# Altium schematic sheet Power Input_V2.SchDoc
size A3; SheetNumber: 2; SheetTotal: 6
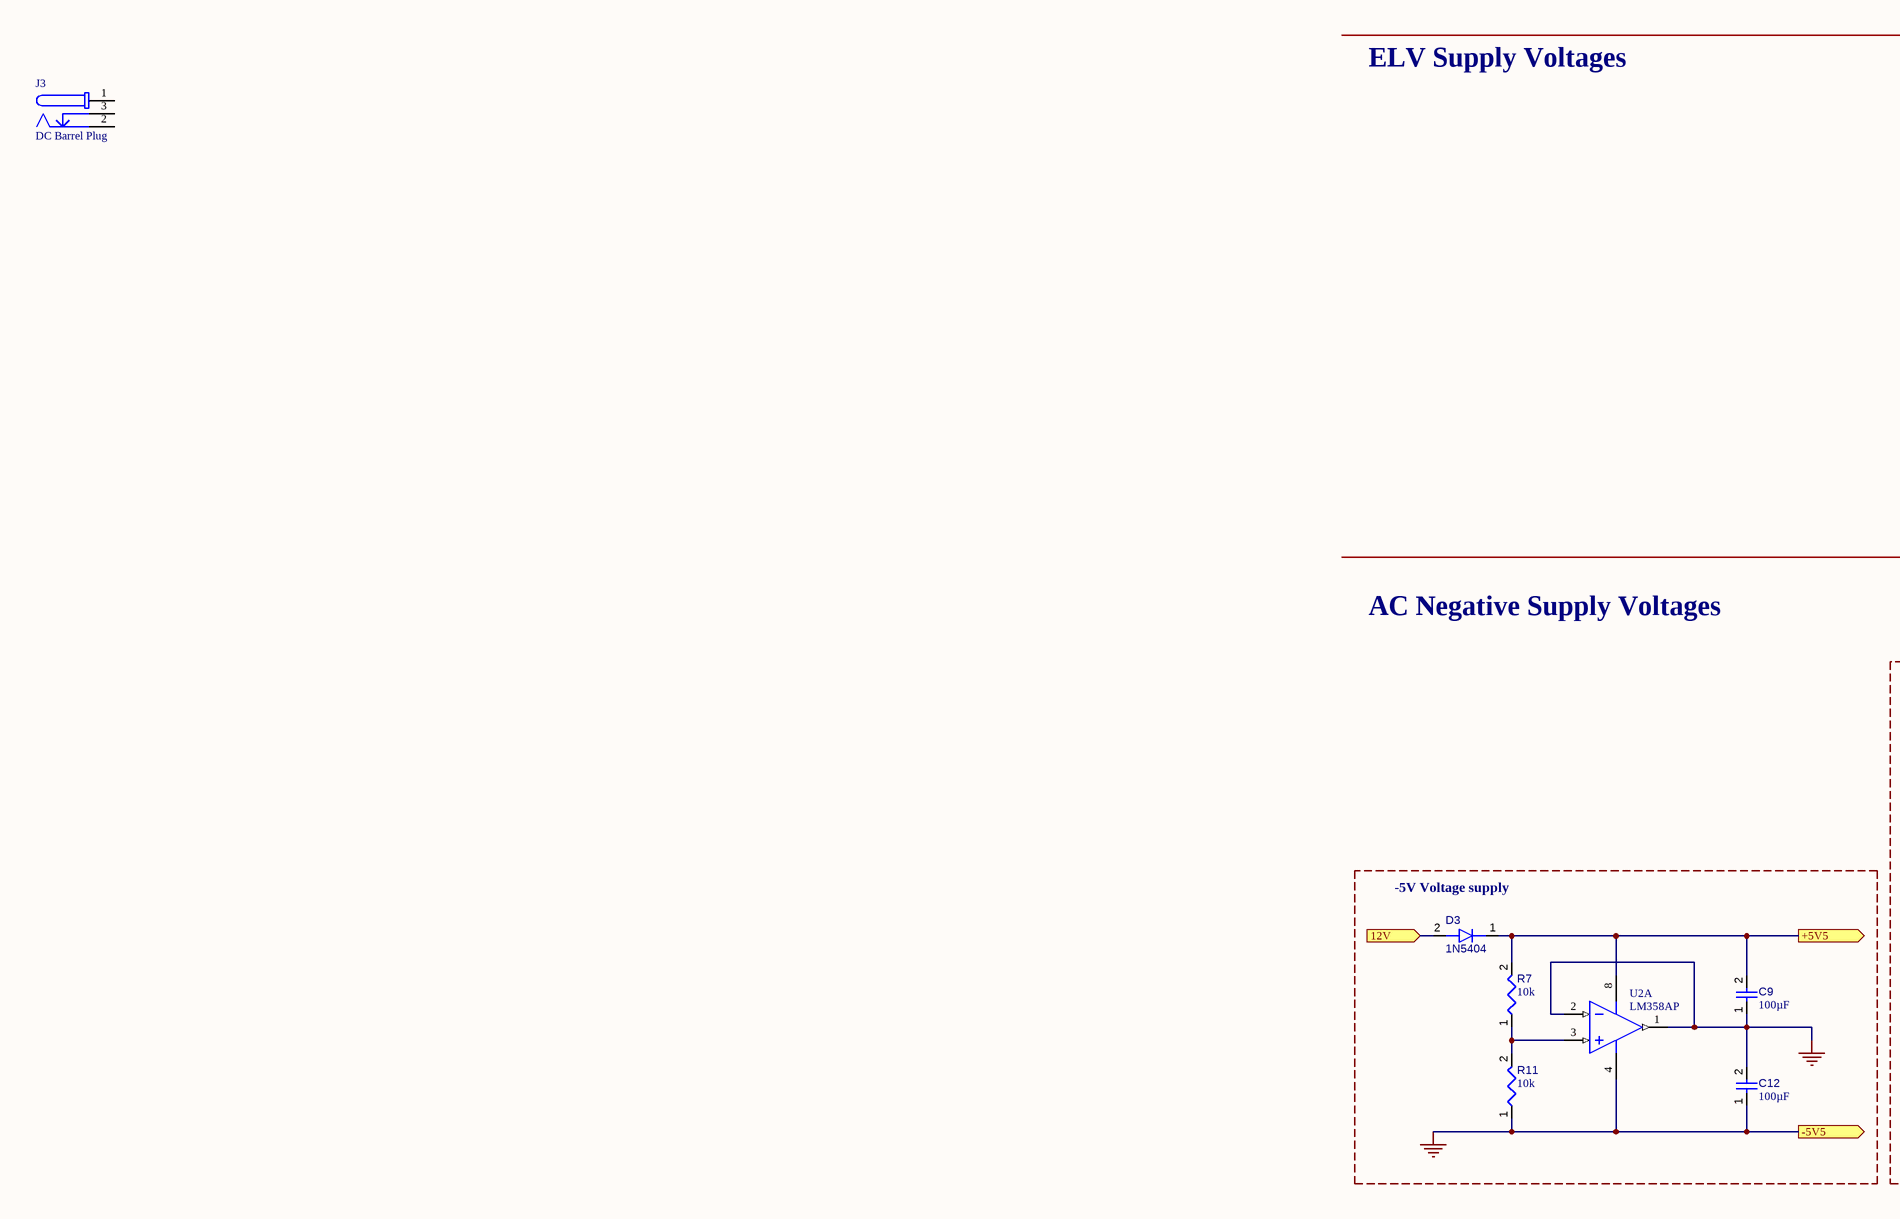
[diagram p0: Power Input_V2.SchDoc, left]
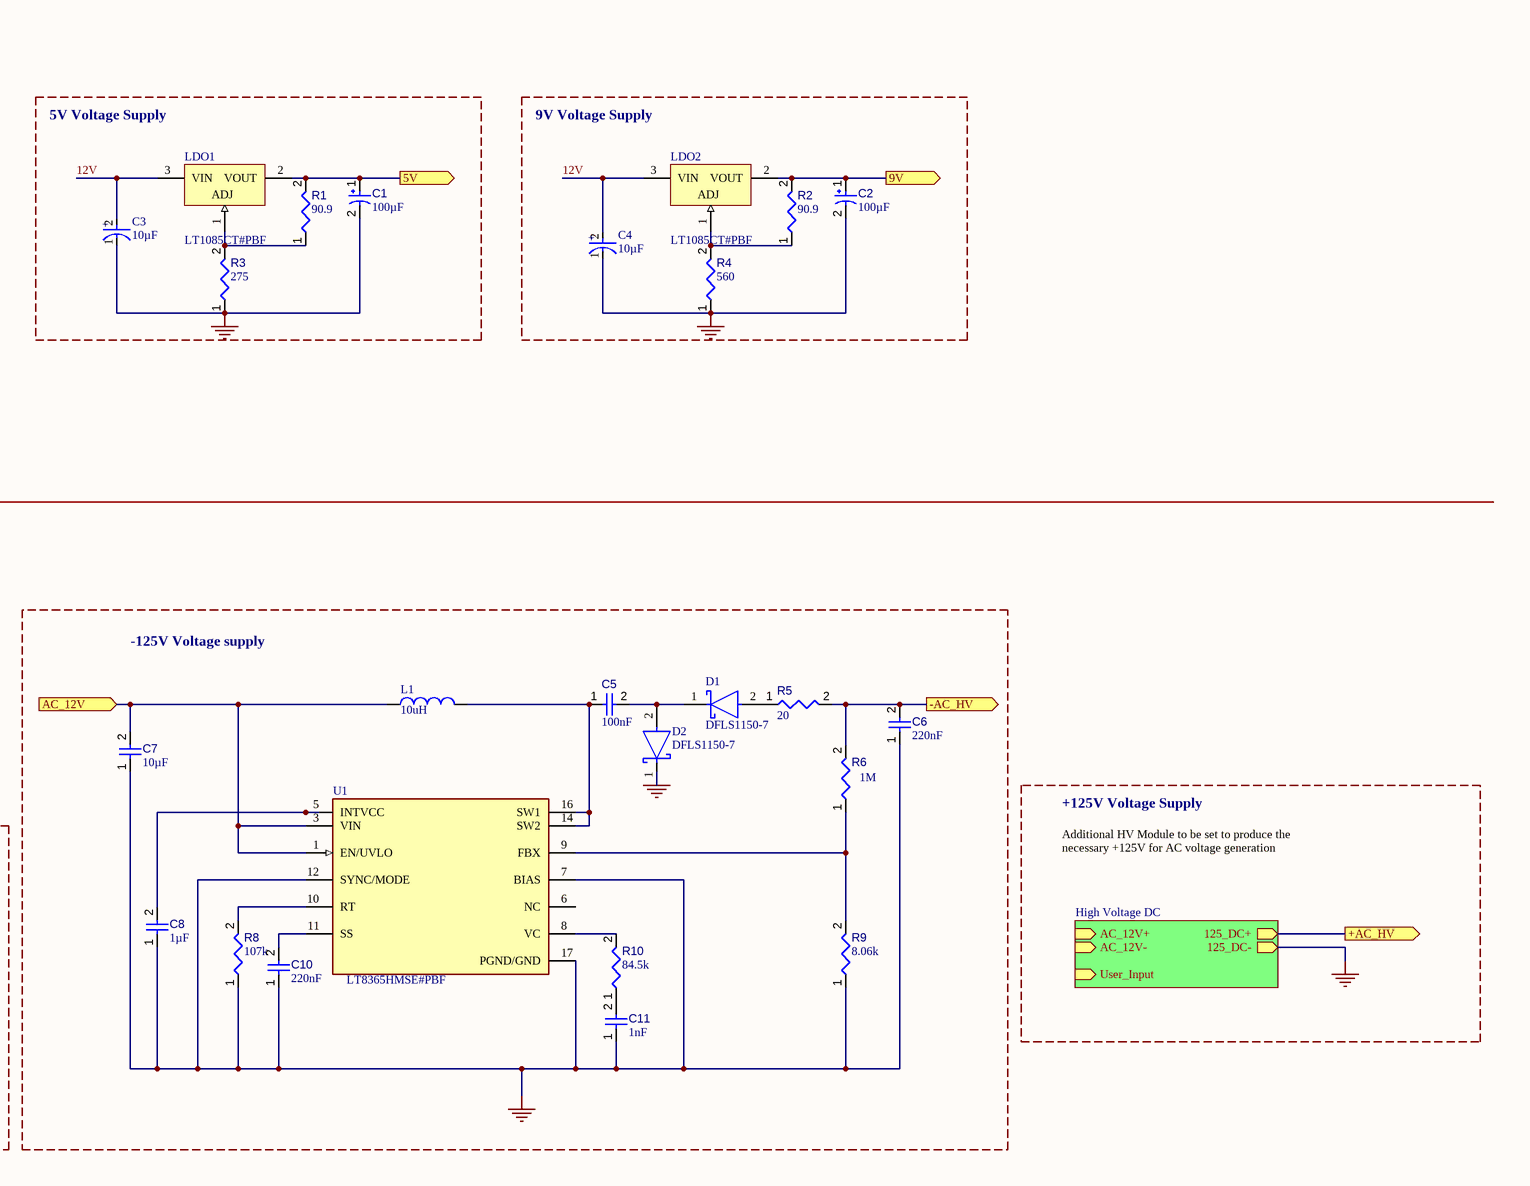
[diagram p1: Power Input_V2.SchDoc, right]

## Parts
C1  value 100µF  [KEMT-T491-D_N]  (hidden comment: T491D107K010AT)
C2  value 100µF  [KEMT-T491-D_N]  (hidden comment: T491D107K010AT)
C3  value 10µF  [FP-T491B106K020AT-MFG]  (hidden comment: T491B106K020AT)
C4  value 10µF  [FP-T491B106K020AT-MFG]  (hidden comment: T491B106K020AT)
C5  value 100nF  [CAPC1210(3225)170_L]  (hidden comment: C1210C104J1RACTU)
C6  value 220nF  [CAPC0402(1005)60_L]  (hidden comment: Capacitor 220nF +/-20% 10V 0402)
C7  value 10µF  [CAPC2013X135X45NL10T25]  (hidden comment: Capacitor 10 uF +/- 10% 16 V 0805)
C8  value 1µF  [CAPC3216X180X20ML20]  (hidden comment: Capacitor 1 uF +/- 10% 25 V 1206)
C9  value 100µF  [RXJ101M1EBK-0811P-Footprint-1]  (hidden comment: RXJ101M1EBK-0811P)
C10  value 220nF  [CAPC0402(1005)60_L]  (hidden comment: Capacitor 220nF +/-20% 10V 0402)
C11  value 1nF  [CAPC0402(1005)33_L]  (hidden comment: Capacitor 1nF +/-20% 50V 0402)
C12  value 100µF  [RXJ101M1EBK-0811P-Footprint-1]  (hidden comment: RXJ101M1EBK-0811P)
D1  DFLS1150-7  [FP-PowerDI123-MFG]
D2  DFLS1150-7  [FP-PowerDI123-MFG]
D3  1N5404  [ONSC-AXIAL_LEAD-2-267-05_V]
J3  DC Barrel Plug  [694108106102]
L1  value 10uH  [WE-LHMI_4020]  (hidden comment: 74437324100)
LDO1  LT1085CT#PBF  [LT-T-3]
LDO2  LT1085CT#PBF  [LT-T-3]
R1  value 90.9  [RESC3216X70X50NL05T20]  (hidden comment: ERJ-8ENF90R9V)
R2  value 90.9  [RESC3216X70X50NL05T20]  (hidden comment: ERJ-8ENF90R9V)
R3  value 275  [1-1879643-4-Footprint-1]  (hidden comment: 1-1879643-4)
R4  value 560  [RESC3216X70X50NL20T25]  (hidden comment: ERA-8AEB561V)
R5  value 20  [RESC3216X70X50NL05T20]  (hidden comment: ERJ-8ENF20R0V)
R6  value 1M  [RESC2550X06N]  (hidden comment: 3430H2F1M0TDF)
R7  value 10k  [FP-MF0207-MFG]  (hidden comment: MF0207FTE52-10K)
R8  value 107k  (hidden comment: MBA02040C1073FC100)
R9  value 8.06k  (hidden comment: MFR-25FTF52-8K06)
R10  value 84.5k  [FP-CR1206-IPC_C]  (hidden comment: CR1206-FX-8452ELF)
R11  value 10k  [FP-MF0207-MFG]  (hidden comment: MF0207FTE52-10K)
U1  LT8365HMSE#PBF  [FP-MSE-16-05-08-1871-MFG]
U2  LM358AP  [P0008A]  (part A of 2)

## Blocks framed on the sheet
5V Voltage Supply: C1 C3 LDO1 R1 R3
9V Voltage Supply: C2 C4 LDO2 R2 R4
-125V Voltage supply: C5-C8 C10 C11 D1 D2 L1 R5 R6 R8-R10 U1
-5V Voltage supply: C9 C12 D3 R7 R11 U2

## Sub-sheets
High Voltage DC = File Name: AC_12V+ (in), AC_12V- (in), User_Input (in), 125_DC+ (out), 125_DC- (out)

## Ports
5V (out), 9V (out), 12V (in), +5V5 (out), +AC_HV (out), -5V5 (out), -AC_HV (out), AC_12V (in)

## Nets
GND: C1.2 C2.2 C3.1(C) C4.1(C) C6.1 C7.1 C8.1 C9.1 C10.1 C11.1 C12.1 C12.2 D2.1(C) R3.1 R4.1 R8.1 R9.1 R11.1 U1.7(BIAS) U1.12(SYNC/MODE) U1.17(PGND/GND) U2.1(1OUT) U2.2(1IN-) U2.4(GND) ; port -5V5, sheet High Voltage DC/125_DC-
5V: C1.1 LDO1.2(VOUT) R1.2 ; port 5V
9V: C2.1 LDO2.2(VOUT) R2.2 ; port 9V
12V: D3.2(A) ; port 12V
12V: C3.2(A) C4.2(A) LDO1.3(VIN) LDO2.3(VIN)  [a separate net that carries the same name]
+5V5: C9.2 D3.1(K) R7.2 U2.8(VCC) ; port +5V5
+AC_HV: port +AC_HV, sheet High Voltage DC/125_DC+
-AC_HV: C6.2 R5.2 R6.2 ; port -AC_HV
AC_12V: C7.2 L1.1 U1.1(EN/UVLO) U1.3(VIN) ; port AC_12V
NetC5_1: C5.1 L1.2 U1.14(SW2) U1.16(SW1)
NetC5_2: C5.2 D1.1(C) D2.2(A)
NetC8_2: C8.2 U1.5(INTVCC)
NetC10_2: C10.2 U1.11(SS)
NetC11_2: C11.2 R10.1
NetD1_2: D1.2(A) R5.1
NetLDO1_1: LDO1.1(ADJ) R1.1 R3.2
NetLDO2_1: LDO2.1(ADJ) R2.1 R4.2
NetR6_1: R6.1 R9.2 U1.9(FBX)
NetR7_1: R7.1 R11.2 U2.3(1IN+)
NetR8_2: R8.2 U1.10(RT)
NetR10_2: R10.2 U1.8(VC)

Not connected (* = marked no-connect by the designer): J3 1 2 3; U1 6(NC)

## Notes on the sheet
- ELV Supply Voltages
- AC Negative Supply Voltages
- +125V Voltage Supply
- Additional HV Module to be set to produce the necessary +125V for AC voltage generation
- (in symbol CMP-001-00088-1) +

## Library data of the parts
C1 C2 = CMP-001-00037-7: Tantalum Surface Mount Capacitor-Standard Tantalum, 100 uF, +/- 10%, 10 V, -55 to 125 degC, 2917 (7343 Metric), RoHS, Tape and Reel; Manufacturer: Kemet; Ripple Current: 463mA; ESR: 700mohm; Voltage Rating: 10V; Tolerance: 10%; Packaging: TapeandReel; Datasheet Version: Jun-16; Package Quantity: 1; Max Operating Temperature: 125°C; Package Reference: T491-D; Pins: 2; Mounting Technology: SM; Datasheet URL: http://www.kemet.com/Lists/ProductCatalog/Attachments/254/KEM_T2005_T491.pdf; Min Operating Temperature: -55°C; Package Description: 2-Pin Surface Mount Device, Body 7.3 x 4.3 mm; RoHS Compliant: True; Case/Package: 2917; Capacitor Type: Tantalum; Manufacturer URL: http://www.kemet.com/
C3 C4 = CMP-001-00088-1: Tantalum Capacitor, Polarized, Tantalum (dry/solid), 20V, 10% +Tol, 10% -Tol, 10uF, Surface Mount, 1411; Ripple Current: 80.4mA; Max Operating Temperature: 125°C; Case/Package: 1411; Mounting Technology: Surface Mount; RoHS Compliant: Yes; Min Operating Temperature: -55°C; Pins: 2; Capacitor Type: Tantalum
C5 = CMP-001-00090-1: Ceramic Capacitor, Multilayer, Ceramic, 100V, 5% +Tol, 5% -Tol, X7R, 15% TC, 0.1uF, Surface Mount, 1210; Min Operating Temperature: -55°C; Case/Package: 1210; Max Operating Temperature: 125°C; RoHS Compliant: Yes; Pins: 2; Capacitor Type: Ceramic; Mounting Technology: Surface Mount
C6 C10 = CMP-001-00057-3: Chip Capacitor, 220nF +/-20%, 10V, 0402, Thickness 0.6 mm; Tolerance: 10%; Max Operating Temperature: 85°C; Pins: 2; Case/Package: 0402; Mounting Technology: SMT; Voltage Rating: 10V; Min Operating Temperature: -55°C
C7 = CMP-001-00015-6: Chip Capacitor, 10 uF, +/- 10%, 16 V, 0805 (2012 Metric); Voltage Rating: 16V; Capacitor Type: Ceramic; RoHS Compliant: True; Max Operating Temperature: 85°C; Min Operating Temperature: -55°C; Mounting Technology: SM; Tolerance: 10%; Case/Package: 0805; Pins: 2
C8 = CMP-001-00006-6: Chip Capacitor, 1 uF, +/- 10%, 25 V, 1206 (3216 Metric); Capacitor Type: Ceramic; Voltage Rating: 25V; Tolerance: 10%; Min Operating Temperature: -55°C; Pins: 2; Case/Package: 1206; Max Operating Temperature: 125°C; Mounting Technology: SM; RoHS Compliant: True
C9 C12 = CMP-001-00089-2: Aluminum Electrolytic Capacitors - Leaded 25V 100uF 105C 8x11.5 mm
C11 = CMP-001-00066-3: Chip Capacitor, 1nF +/-20%, 50V, 0402, Thickness 0.33 mm; Tolerance: 10%; Case/Package: 0402; Pins: 2; Min Operating Temperature: -55°C; Max Operating Temperature: 85°C; Voltage Rating: 50V; Mounting Technology: SMT
D1 D2 = CMP-004-00032-1: Rectifier Diode, Schottky, 1 Phase, 1 Element, 1A, 150V V(RRM), Silicon; Forward Voltage: 820mV; RoHS Compliant: Yes; Pins: 2; Min Operating Temperature: -55°C; Max Operating Temperature: 175°C
D3 = CMP-004-00031-1: Rectifier Diode, 1 Phase, 1 Element, 3A, 400V V(RRM), Silicon; Forward Voltage: 1V; Max Operating Temperature: 150°C; Pins: 2; RoHS Compliant: Yes
J3 = CMP-015-00011-1: 24V, 5A, 2.5mm Dia, surface mounted; Connector Type: Circular,Power; Mounting Technology: Board; RoHS Compliant: Yes
L1 = CMP-006-00021-1: General Purpose Inductor, 10uH, 20%, 1 Element, Powdered  Iron-Core, SMD, 1816; RoHS Compliant: Yes
LDO1 LDO2 = CMP-019-00052-1: Adjustable Positive LDO Regulator, 1.2V Min, 15V Max, 1.5V Dropout, BIPolar, PSFM3; RoHS Compliant: Yes; Pins: 3; Case/Package: TO-220
R1 R2 = CMP-009-00182-1: Fixed Resistor, Metal Glaze/thick Film, 0.25W, 90.9ohm, 200V, 1% +/-Tol, 100ppm/Cel, Surface Mount, 1206; Power: 250mW; RoHS Compliant: Yes; Case/Package: 1206; Min Operating Temperature: -55°C; Mounting Technology: Surface Mount; Tolerance: 1%; Max Operating Temperature: 155°C; Pins: 2
R3 = CMP-009-00184-1: Fixed Resistor, Thin Film, 0.25W, 275ohm, 350V, 0.5% +/-Tol, 50ppm/Cel, Through Hole Mount; Power: 250mW; RoHS Compliant: Yes; Mounting Technology: Through Hole; Pins: 2; Tolerance: 0.5%
R4 = CMP-009-00177-1: Fixed Resistor, Thin Film, 0.25W, 560ohm, 150V, 0.1% +/-Tol, 25ppm/Cel, Surface Mount, 1206; Power: 250mW; Max Operating Temperature: 155°C; Pins: 2; Mounting Technology: Surface Mount; Min Operating Temperature: -55°C; RoHS Compliant: Yes; Case/Package: 1206; Tolerance: 0.1%
R5 = CMP-009-00187-1: Fixed Resistor, Metal Glaze/thick Film, 0.25W, 20ohm, 200V, 1% +/-Tol, 100ppm/Cel, Surface Mount, 1206; Power: 250mW; Mounting Technology: Surface Mount; Tolerance: 1%; Max Operating Temperature: 155°C; RoHS Compliant: Yes; Pins: 2; Min Operating Temperature: -55°C; Case/Package: 1206
R6 = CMP-009-00190-1: Res, 1M, 2W, Thick Film, 1020 Wide;
R7 R11 = CMP-009-00178-1: Fixed Resistor, Metal Film, 0.6W, 10000ohm, 350V, 1% +/-Tol, 50ppm/Cel, Through Hole Mount; Mounting Technology: Through Hole; Min Operating Temperature: -55°C; Tolerance: 1%; Case/Package: Axial; Max Operating Temperature: 155°C; RoHS Compliant: Yes
R8 = CMP-009-00188-1: Fixed Resistor, Metal Film, 0.25W, 107000ohm, 200V, 1% +/-Tol, 50ppm/Cel, Through Hole Mount; Power: 400mW; Pins: 2; Tolerance: 1%; RoHS Compliant: Yes; Mounting Technology: Through Hole; Min Operating Temperature: -55°C; Max Operating Temperature: 155°C
R9 = CMP-009-00191-1: Fixed Resistor, Metal Film, 0.25W, 8060ohm, 250V, 1% +/-Tol, 100ppm/Cel, Through Hole Mount; Power: 250mW; Max Operating Temperature: 155°C; RoHS Compliant: Yes; Tolerance: 1%; Min Operating Temperature: -55°C; Mounting Technology: Through Hole; Pins: 2
R10 = CMP-009-00189-1: Fixed Resistor, Metal Glaze/thick Film, 0.25W, 84500ohm, 200V, 1% +/-Tol, 100ppm/Cel, Surface Mount, 1206; Power: 250mW; Mounting Technology: Surface Mount; Max Operating Temperature: 155°C; Case/Package: 1206; Min Operating Temperature: -55°C; Pins: 2; RoHS Compliant: Yes; Tolerance: 1%
U1 = CMP-031-00008-1: Switching Regulator, Current-mode, 535kHz Switching Freq-Max, BIPolar, PDSO12; RoHS Compliant: Yes
U2 = CMP-014-00023-2: Dual Operational Amplifier, 3 to 32 V, 0 to 70 degC, 8-Pin PDIP (P), Pb-Free (RoHS), Tube; Manufacturer: Texas Instruments (TI); Channels: 2; Max Dual Supply Voltage: 16V; Min Dual Supply Voltage: 1.5V; Slew Rate: 0.3V/us; Unity Gain Bandwidth Product: 700KHz; Common Mode Rejection Ratio: 65dB; Nominal Supply Voltage: 5V; Package Version: 4040082/E, 04/2010; Output Current: 30mA; Nominal Supply Current: 1.2mA; Nominal Voltage Gain: 100dB; Case/Package: DIP; Max Operating Temperature: 70°C; RoHS Compliant: True; Manufacturer URL: http://www.ti.com/; Pins: 8; Package Description: 8-Pin Double In-line Package, Body 9.59 x 6.35 mm, Pitch 2.54 mm; Datasheet URL: http://www.ti.com/lit/ds/symlink/lm358a.pdf; Max Supply Voltage: 16V; Package Reference: P0008A; Mounting Technology: TH; Min Operating Temperature: 0°C; Package URL: http://www.ti.com/lit/ml/mpdi001b/mpdi001b.pdf; Min Supply Voltage: 1.5V; Package Quantity: 50; Packaging: Rail/Tube; Datasheet Version: SLOS068T, 04/2015; Nominal Gain Bandwith Product: 700KHz